# Altium project D AMP.PrjPcb
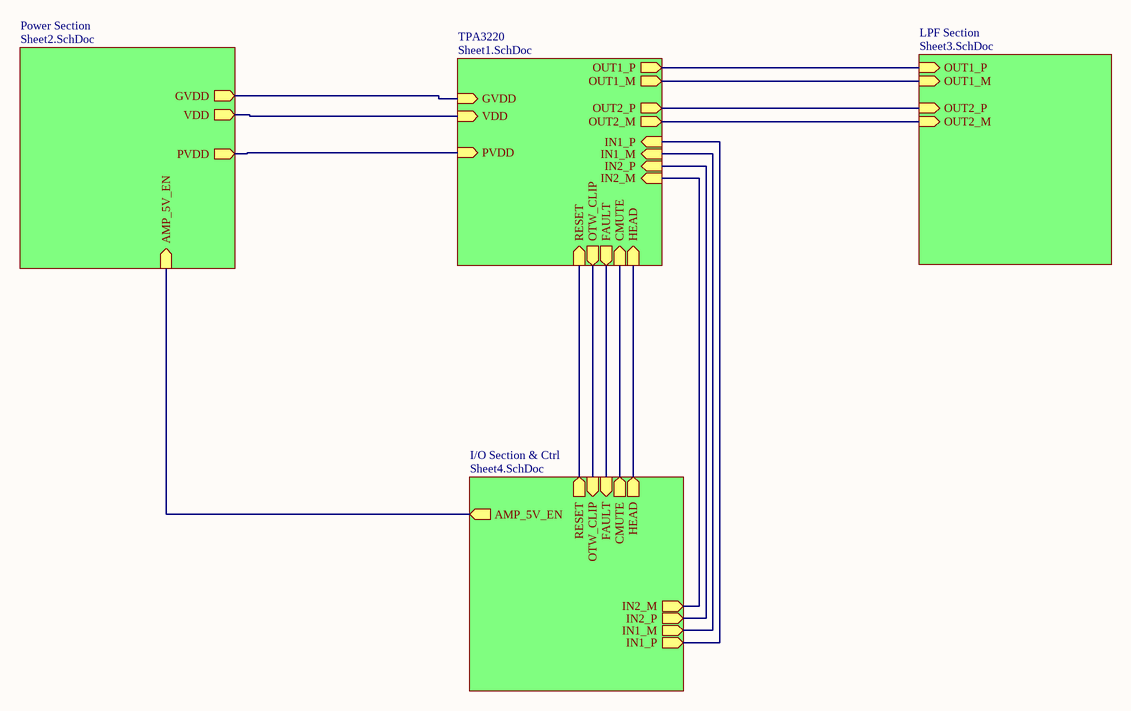
[diagram p0: ROOT_Sheet.SchDoc]
=revision: 1.0; =title: D AMP
5 sheets, 97 parts. Net scope: hierarchical (ports join the sheet entries above them; power ports are global).
Board file: DAMP.PcbDoc
Sheets:
  ROOT_Sheet.SchDoc
    TPA3220 = Sheet1.SchDoc
    I/O Section & Ctrl = Sheet4.SchDoc
    LPF Section = Sheet3.SchDoc
    Power Section = Sheet2.SchDoc

## Sheet ROOT_Sheet.SchDoc: D AMP
size A4; Revision: 1.0; SheetNumber: 5; SheetTotal: 5

### Sub-sheets
I/O Section & Ctrl = Sheet4.SchDoc: AMP_5V_EN (out), HEAD (out), CMUTE (out), FAULT (in), OTW_CLIP (in), IN1_P (out), IN1_M (out), IN2_P (out), IN2_M (out), RESET (out)
LPF Section = Sheet3.SchDoc: OUT1_P (in), OUT1_M (in), OUT2_P (in), OUT2_M (in)
Power Section = Sheet2.SchDoc: GVDD (out), VDD (out), PVDD (out), AMP_5V_EN (in)
TPA3220 = Sheet1.SchDoc: GVDD (in), VDD (in), PVDD (in), OTW_CLIP (out), FAULT (out), CMUTE (in), HEAD (in), OUT1_P (out), OUT1_M (out), OUT2_P (out), OUT2_M (out), IN1_P (in), IN1_M (in), IN2_P (in), IN2_M (in), RESET (in)

### Nets
PVDD: sheet TPA3220/PVDD, sheet Power Section/PVDD
GVDD: sheet TPA3220/GVDD, sheet Power Section/GVDD
OUT1_M: sheet TPA3220/OUT1_M, sheet LPF Section/OUT1_M
OUT1_P: sheet TPA3220/OUT1_P, sheet LPF Section/OUT1_P
OUT2_M: sheet TPA3220/OUT2_M, sheet LPF Section/OUT2_M
OUT2_P: sheet TPA3220/OUT2_P, sheet LPF Section/OUT2_P
VDD: sheet TPA3220/VDD, sheet Power Section/VDD
NetC3_2: sheet TPA3220/RESET, sheet I/O Section & Ctrl/RESET
NetC40_1: sheet TPA3220/IN1_M, sheet I/O Section & Ctrl/IN1_M
NetC40_2: sheet TPA3220/IN1_P, sheet I/O Section & Ctrl/IN1_P
NetC44_1: sheet TPA3220/IN2_M, sheet I/O Section & Ctrl/IN2_M
NetC44_2: sheet TPA3220/IN2_P, sheet I/O Section & Ctrl/IN2_P
NetIC1_3: sheet TPA3220/OTW_CLIP, sheet I/O Section & Ctrl/OTW_CLIP
NetIC1_4: sheet TPA3220/FAULT, sheet I/O Section & Ctrl/FAULT
NetIC1_11: sheet TPA3220/HEAD, sheet I/O Section & Ctrl/HEAD
NetIC1_17: sheet TPA3220/CMUTE, sheet I/O Section & Ctrl/CMUTE
NetJ4_20: sheet I/O Section & Ctrl/AMP_5V_EN, sheet Power Section/AMP_5V_EN

### Notes on the sheet
- Size:
- Date:
- A4
- Author:
- Time:
- Title
- Lovepreet Singh
- Sheet
- Revision:
- of
- File:

## Sheet Sheet1.SchDoc: D AMP
size A4; DocumentNumber: 0001; Revision: 1.0; SheetNumber: 1; SheetTotal: 5
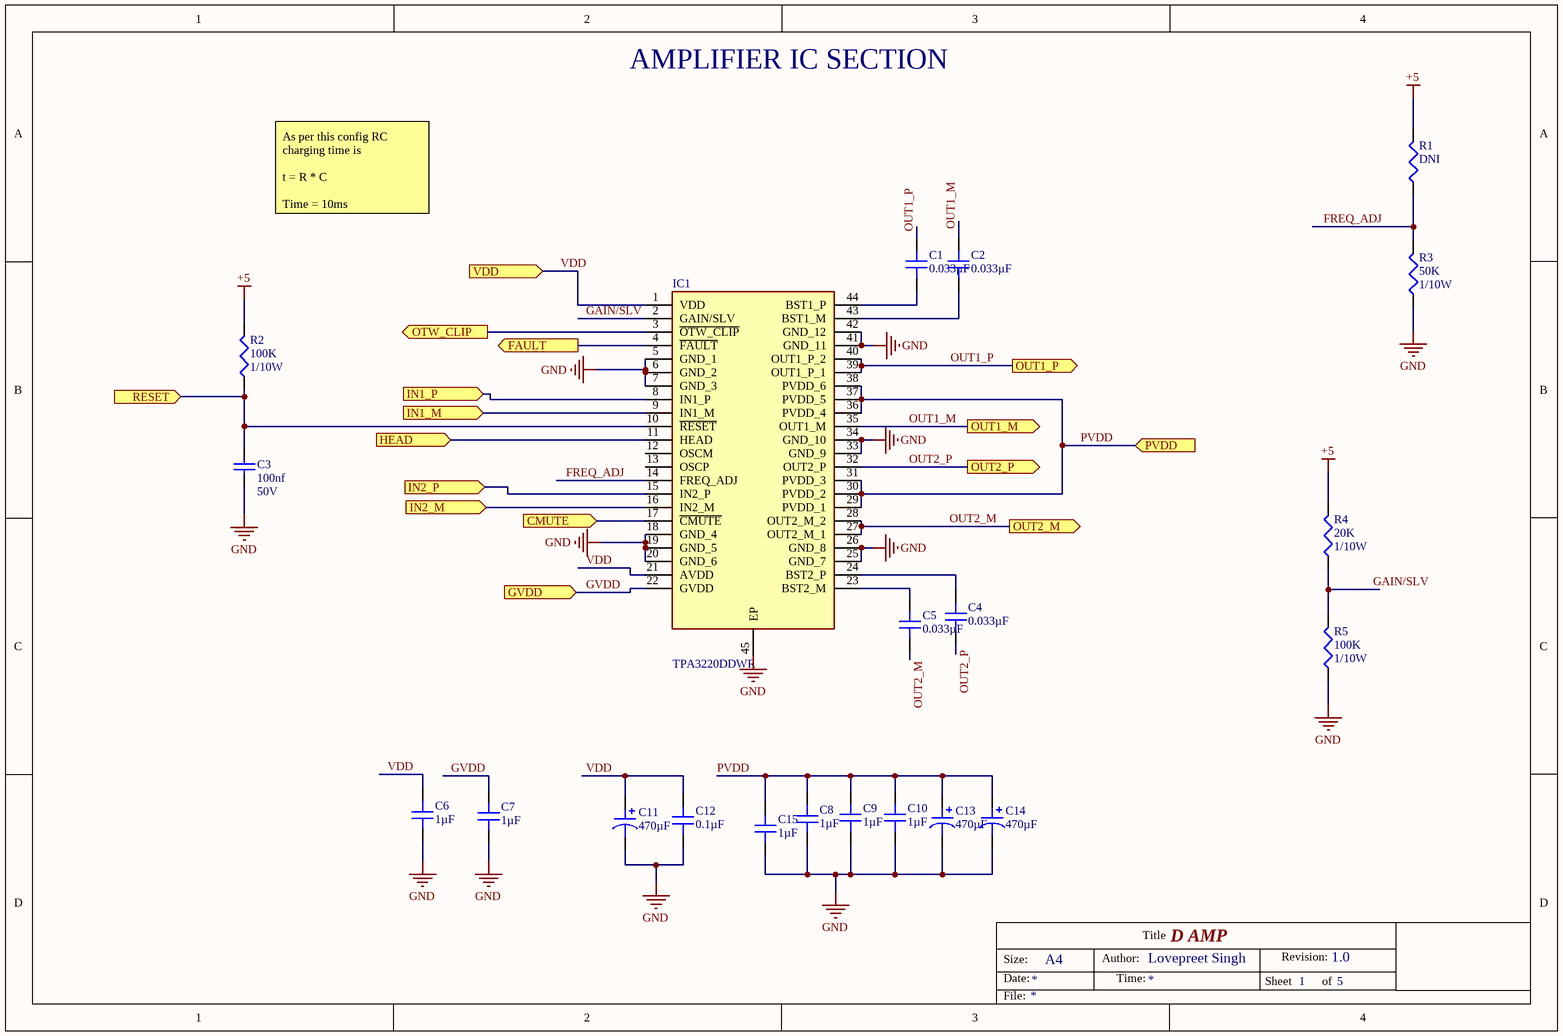
[diagram p1: Sheet1.SchDoc]

### Parts
C1  0.033µF  [CAP 0603_1608]
C2  0.033µF  [CAP 0603_1608]
C3  100nf  VRating: 50V  [C0603]
C4  0.033µF  [CAP 0603_1608]
C5  0.033µF  [CAP 0603_1608]
C6  1µF  [CAP 0805_2012]
C7  1µF  [CAP 0805_2012]
C8  1µF  [CAP 0805_2012]
C9  1µF  [CAP 0805_2012]
C10  1µF  [CAP 0805_2012]
C11  470µF  [CAP TH ALUM ELEC D12.50mm S5.00mm H27.00mm]
C12  0.1µF  [CAP 0805_2012]
C13  470µF  [CAP TH ALUM ELEC D12.50mm S5.00mm H27.00mm]
C14  470µF  [CAP TH ALUM ELEC D12.50mm S5.00mm H27.00mm]
C15  1µF  [CAP 0805_2012]
IC1  TPA3220DDWR  [SOP64P810X120-45N]
R1  DNI  [R0603]
R2  100K  PRating: 1/10W  [R0603]
R3  50K  PRating: 1/10W  [R0603]
R4  20K  PRating: 1/10W  [R0603]
R5  100K  PRating: 1/10W  [R0603]

### Ports
CMUTE (in), FAULT (out), GVDD (in), HEAD (in), IN1_M (in), IN1_P (in), IN2_M (in), IN2_P (in), OTW_CLIP (out), OUT1_M (out), OUT1_P (out), OUT2_M (out), OUT2_P (out), PVDD (in), RESET (in), VDD (in)

### Nets
+5: R1.2 R2.2 R4.2
GND: C3.1 C6.1 C7.1 C8.1 C9.1 C10.1 C11.2 C12.1 C13.2 C14.2 C15.1 IC1.5(GND_1) IC1.6(GND_2) IC1.7(GND_3) IC1.18(GND_4) IC1.19(GND_5) IC1.20(GND_6) IC1.25(GND_7) IC1.26(GND_8) IC1.33(GND_9) IC1.34(GND_10) IC1.41(GND_11) IC1.42(GND_12) IC1.45(EP) R3.1 R5.1
PVDD: C8.2 C9.2 C10.2 C13.1 C14.1 C15.2 IC1.29(PVDD_1) IC1.30(PVDD_2) IC1.31(PVDD_3) IC1.36(PVDD_4) IC1.37(PVDD_5) IC1.38(PVDD_6) ; port PVDD
FREQ_ADJ: IC1.14(FREQ_ADJ) R1.1 R3.2
GAIN/SLV: IC1.2(GAIN/SLV) R4.1 R5.2
GVDD: C7.2 IC1.22(GVDD) ; port GVDD
OUT1_M: C2.2 IC1.35(OUT1_M) ; port OUT1_M
OUT1_P: C1.2 IC1.39(OUT1_P_1) IC1.40(OUT1_P_2) ; port OUT1_P
OUT2_M: C5.1 IC1.27(OUT2_M_1) IC1.28(OUT2_M_2) ; port OUT2_M
OUT2_P: C4.1 IC1.32(OUT2_P) ; port OUT2_P
VDD: C6.2 C11.1 C12.2 IC1.1(VDD) IC1.21(AVDD) ; port VDD
NetC1_1: C1.1 IC1.44(BST1_P)
NetC2_1: C2.1 IC1.43(BST1_M)
NetC3_2: C3.2 IC1.10(~{RESET}) R2.1 ; port RESET
NetC4_2: C4.2 IC1.24(BST2_P)
NetC5_2: C5.2 IC1.23(BST2_M)
NetC40_1: IC1.9(IN1_M) ; port IN1_M
NetC40_2: IC1.8(IN1_P) ; port IN1_P
NetC44_1: IC1.16(IN2_M) ; port IN2_M
NetC44_2: IC1.15(IN2_P) ; port IN2_P
NetIC1_3: IC1.3(~{OTW_CLIP}) ; port OTW_CLIP
NetIC1_4: IC1.4(~{FAULT}) ; port FAULT
NetIC1_11: IC1.11(HEAD) ; port HEAD
NetIC1_17: IC1.17(~{CMUTE}) ; port CMUTE

Not connected (* = marked no-connect by the designer): IC1 12(OSCM) 13(OSCP)

### Notes on the sheet
- AMPLIFIER IC SECTION
- As per this config RC charging time is
  t = R * C
  Time = 10ms
- Size:
- Date:
- A4
- Author:
- Time:
- Title
- Lovepreet Singh
- Sheet
- Revision:
- of
- File:

### Library data of the parts
C1 C2 C4 C5 = C1608X8R2A333K080AB: CAP CER 0.033UF 100V X8R 0603; Manufacturer: TDK Corporation; Tolerance: ±10%; Part Number: C1608X8R2A333K080AB; Value: 0.033µF; Applications: General Purpose; Capacitance: 0.033µF; ComponentLink1Description: Datasheet; ComponentLink1URL: https://product.tdk.com/info/en/catalog/datasheets/mlcc_commercial_hightemp_en.pdf?ref_disty=digikey; ComponentLink2Description: DigiKey Link; ComponentLink2URL: http://digikey.com/product-detail/en/tdk-corporation/C1608X8R2A333K080AB/445-14287-1-ND/3955953; Device Package: 0603 (1608 Metric); Features: High Temperature; LastUpdated: 02-09-2020 01:03:34 AM; Lifecycle Status: Active; Minimum Order: 1; Mounting Type: Surface Mount, MLCC; Operating Temperature: -55°C ~ 150°C; Package / Case: 0603 (1608 Metric); Packaging: TapeAndReel; PartId: 3282; Part Status: Active; Price: 0.05; Series: C; Size / Dimension: 0.063" L x 0.031" W (1.60mm x 0.80mm); Supplier 1: DigiKey; Supplier Part Number 1: 445-14287-1-ND; Temperature Coefficient: X8R; Thickness (Max): 0.035" (0.90mm); Voltage - Rated: 100V
C3 = CAP-00018: CAP CER 100NF 10% 50V X7R 0603; Manufacturer 1: Yageo; Manufacturer 1 PN: CC0603KRX7R9BB104; Manufacturer 2 PN: GRM188R71H104KA93D; Manufacturer 3 PN: 06035C104KAT2A; SAP PN: 1100013274; SMD/TH: SMD; PB-Free: UNKNOWN; DB Ref: CAP-00018; Life Cycle: Released; Value: 100nf; Tolerence: 10%; TRating: X7R; Manufacturer 2: Murata; Manufacturer 3: AVX; ROHS Comp: YES; Operating Temp: -55°C to +125°C; Grade: UNKNOWN
C6-C10 C15 = GCM21BR71H105KA03L: CAP CER 1UF 50V X7R 0805; Manufacturer: Murata Electronics; Tolerance: ±10%; Part Number: GCM21BR71H105KA03L; Value: 1µF; Applications: Automotive; Capacitance: 1µF; ComponentLink1Description: Datasheet; ComponentLink1URL: https://www.murata.com/~/media/webrenewal/support/library/catalog/products/capacitor/mlcc/c03e.ashx?la=en-us; ComponentLink2Description: DigiKey Link; ComponentLink2URL: http://digikey.com/product-detail/en/murata-electronics/GCM21BR71H105KA03L/490-10675-1-ND/5251430; Device Package: 0805 (2012 Metric); LastUpdated: 02-09-2020 01:04:41 AM; Lifecycle Status: Active; Minimum Order: 1; Mounting Type: Surface Mount, MLCC; Operating Temperature: -55°C ~ 125°C; Package / Case: 0805 (2012 Metric); Packaging: TapeAndReel; PartId: 2659; Part Status: Active; Price: 0.08; Ratings: AEC-Q200; Series: GCM; Size / Dimension: 0.079" L x 0.049" W (2.00mm x 1.25mm); Supplier 1: DigiKey; Supplier Part Number 1: 490-10675-1-ND; Temperature Coefficient: X7R; Thickness (Max): 0.055" (1.40mm); Voltage - Rated: 50V
C11 C13 C14 = UBT1H471MHD: CAP 470UF 50V RAD; Manufacturer: Nichicon; Impedance: 55 mOhms; Lifetime @ Temp.: 10000 Hrs @ 125°C; Polarization: Polar; Ripple Current @ High Frequency: 1.65A @ 100kHz; Ripple Current @ Low Frequency: 825mA @ 120Hz; Tolerance: ±20%; Part Number: UBT1H471MHD; Applications: Automotive; Capacitance: 470µF; ComponentLink1Description: Datasheet; ComponentLink1URL: http://nichicon-us.com/english/products/pdfs/e-ubt.pdf; ComponentLink2Description: DigiKey Link; ComponentLink2URL: http://digikey.com/product-detail/en/nichicon/UBT1H471MHD/493-16220-ND/1832524; Device Package: Radial, Can; Height - Seated (Max): 1.063" (27.00mm); LastUpdated: 02-09-2020 01:32:15 AM; Lead Spacing: 0.197" (5.00mm); Lifecycle Status: Active; Minimum Order: 1; Mounting Type: Through Hole; Operating Temperature: -40°C ~ 125°C; Package / Case: Radial, Can; Packaging: Unknown; PartId: 15304; Part Status: Active; Price: 1.65; Series: UBT; Size / Dimension: 0.492" Dia (12.50mm); Supplier 1: DigiKey; Supplier Part Number 1: 493-16220-ND; Value: 470µF; Voltage - Rated: 50V
C12 = AC0805KKX8R9BB104: CAP CER 0805 10% X8R 50V 100NF; Manufacturer: Yageo; Part Number: AC0805KKX8R9BB104; Value: 0.1µF; Applications: Automotive; Capacitance: 0.1µF; ComponentLink1Description: Datasheet; ComponentLink1URL: http://www.yageo.com/documents/recent/AC0805KKX8R9BB104.pdf; ComponentLink2Description: DigiKey Link; ComponentLink2URL: http://digikey.com/product-detail/en/yageo/AC0805KKX8R9BB104/311-4624-1-ND/9699550; Device Package: 0805 (2012 Metric); LastUpdated: 02-09-2020 01:04:20 AM; Lifecycle Status: Active; Minimum Order: 1; Mounting Type: Surface Mount, MLCC; Operating Temperature: -55°C ~ 150°C; Package / Case: 0805 (2012 Metric); Packaging: TapeAndReel; PartId: 14076; Part Status: Active; Price: 0.06; Ratings: AEC-Q200; Series: AC; Size / Dimension: 0.079" L x 0.049" W (2.00mm x 1.25mm); Supplier 1: DigiKey; Supplier Part Number 1: 311-4624-1-ND; Temperature Coefficient: X8R; Thickness (Max): 0.057" (1.45mm); Tolerance: ±10%; Voltage - Rated: 50V
IC1 = TPA3220DDWR: Integrated Circuit; Manufacturer_Name: Texas Instruments; Datasheet Link: http://www.ti.com/lit/gpn/tpa3220; Height: 1.2mm; Mouser2 Part Number: 595-TPA3220DDWR; Mouser2 Price/Stock: https://www.mouser.com/Search/Refine.aspx?Keyword=595-TPA3220DDWR; Manufacturer_Part_Number: TPA3220DDWR
R1 R4 = RES-00050: RES SMD 20K 1% 1/10W 0603; Manufacturer 1: Yageo; Manufacturer 1 PN: RC0603FR-0720KL; Manufacturer 2 PN: AC0603FR-1020KL; Manufacturer 3 PN: RK73H1JTTD2002F; SAP PN: 1100013992; Tolerance(%): 1; Grade: UNKNOWN; DB Ref: RES-00050; Life Cycle: Released; Manufacturer 2: Yageo; Manufacturer 3: KOA Speer; ROHS Comp: YES; Operating Temp: -55°C to +125°C; SMD/TH: SMD; PB-Free: UNKNOWN
  R1: Value: DNI
  R4: Value: 20K
R2 R5 = RES-00024: RES SMD 100K 1% 1/10W 0603; Manufacturer 1: Yageo; Manufacturer 1 PN: RC0603FR-07100KL; Manufacturer 2 PN: RMCF0603FT100K; Manufacturer 3 PN: RK73H1JRTTD1003F; SAP PN: 1100013339; Tolerance(%): 1; Cost Price: $0.1; Grade: UNKNOWN; DB Ref: RES-00024; Life Cycle: Released; Value: 100K; Manufacturer 2: Stackpole; Manufacturer 3: KOA Speer; ROHS Comp: YES; Operating Temp: -55°C to +155°C; SMD/TH: SMD; PB-Free: UNKNOWN
R3 = RES-00125: RES 50K OHM 1% 1/10W 0603; Manufacturer 1: Yageo; Manufacturer 1 PN: RC0603FR-0750KL; SAP PN: 1100016036; Tolerance(%): 1; SMD/TH: SMD; Grade: UNKNOWN; DB Ref: RES-00125; Life Cycle: Released; Value: 50K; ROHS Comp: YES; Operating Temp: -55°C to +155°C; PB-Free: UNKNOWN

## Sheet Sheet4.SchDoc: D AMP
size A4; Revision: 1.0; SheetNumber: 4; SheetTotal: 5
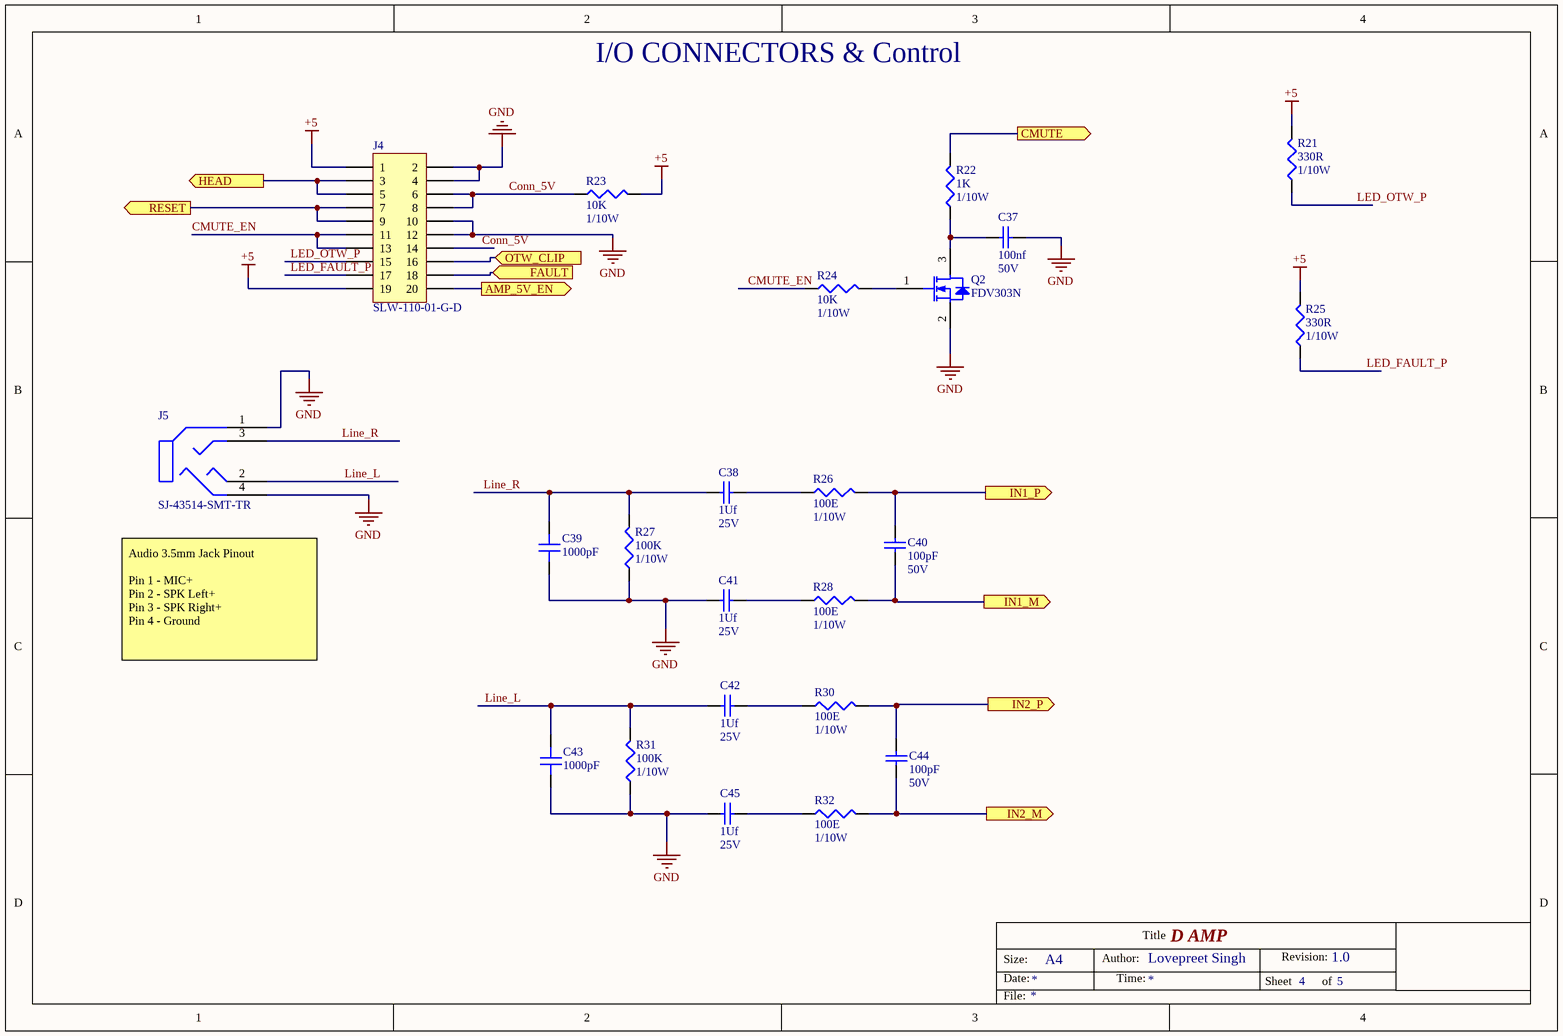
[diagram p2: Sheet4.SchDoc]

### Parts
C37  100nf  VRating: 50V  [C0603]
C38  1Uf  VRating: 25V  [C0603]
C39  1000pF  [CAP 0603_1608]
C40  100pF  VRating: 50V  [C0603]
C41  1Uf  VRating: 25V  [C0603]
C42  1Uf  VRating: 25V  [C0603]
C43  1000pF  [CAP 0603_1608]
C44  100pF  VRating: 50V  [C0603]
C45  1Uf  VRating: 25V  [C0603]
J4  SLW-110-01-G-D  [HDR2X10]
J5  SJ-43514-SMT-TR  [CUI SJ-43514-SMT-TR]
Q2  FDV303N  [SOT23_123]
R21  330R  PRating: 1/10W  [R0603]
R22  1K  PRating: 1/10W  [R0603]
R23  10K  PRating: 1/10W  [R0603]
R24  10K  PRating: 1/10W  [R0603]
R25  330R  PRating: 1/10W  [R0603]
R26  100E  PRating: 1/10W  [R0603]
R27  100K  PRating: 1/10W  [R0603]
R28  100E  PRating: 1/10W  [R0603]
R30  100E  PRating: 1/10W  [R0603]
R31  100K  PRating: 1/10W  [R0603]
R32  100E  PRating: 1/10W  [R0603]

### Ports
AMP_5V_EN (out), CMUTE (out), FAULT (in), HEAD (out), IN1_M (out), IN1_P (out), IN2_M (out), IN2_P (out), OTW_CLIP (in), RESET (out)

### Nets
+5: J4.1 J4.19 R21.2 R23.2 R25.2
GND: C37.2 C39.1 C41.1 C43.1 C45.1 J4.2 J4.4 J4.10 J4.12 J5.1(SLEEVE) J5.4(RING_2) Q2.2(S) R27.1 R31.1
CMUTE_EN: J4.11 J4.13 R24.1
Conn_5V: J4.6 J4.8 J4.14 R23.1
LED_FAULT_P: J4.17 R25.1
LED_OTW_P: J4.15 R21.1
Line_L: C42.1 C43.2 J5.2(TIP) R31.2
Line_R: C38.1 C39.2 J5.3(RING_1) R27.2
NetC3_2: J4.7 J4.9 ; port RESET
NetC37_1: C37.1 Q2.3(D) R22.1
NetC38_2: C38.2 R26.1
NetC40_1: C40.1 R28.2 ; port IN1_M
NetC40_2: C40.2 R26.2 ; port IN1_P
NetC41_2: C41.2 R28.1
NetC42_2: C42.2 R30.1
NetC44_1: C44.1 R32.2 ; port IN2_M
NetC44_2: C44.2 R30.2 ; port IN2_P
NetC45_2: C45.2 R32.1
NetIC1_3: J4.16 ; port OTW_CLIP
NetIC1_4: J4.18 ; port FAULT
NetIC1_11: J4.3 J4.5 ; port HEAD
NetIC1_17: R22.2 ; port CMUTE
NetJ4_20: J4.20 ; port AMP_5V_EN
NetQ2_1: Q2.1(G) R24.2

### Notes on the sheet
- I/O CONNECTORS & Control
- (near J5) Audio 3.5mm Jack Pinout
  Pin 1 - MIC+
  Pin 2 - SPK Left+
  Pin 3 - SPK Right+
  Pin 4 - Ground
- Size:
- Date:
- A4
- Author:
- Time:
- Title
- Lovepreet Singh
- Sheet
- Revision:
- of
- File:

### Library data of the parts
C37 = CAP-00018: as C3 on sheet Sheet1; DB Ref: CAP-00018; Life Cycle: Released; Value: 100nf; Tolerence: 10%; TRating: X7R; Manufacturer 2: Murata; Manufacturer 3: AVX; ROHS Comp: YES; Operating Temp: -55°C to +125°C; Grade: UNKNOWN
C38 C41 C42 C45 = CAP-00113: CAP MLCC SMD 25V 1uF 10% X7R 0603; Manufacturer 1: KEMET; Manufacturer 1 PN: C0603C105K3RACTU; SAP PN: 1100016000; PB-Free: YES; Grade: Commercial; DB Ref: CAP-00113; Life Cycle: Released; Value: 1Uf; Tolerence: 10%; TRating: X7R; ROHS Comp: YES; Operating Temp: -55°C to +125°C; SMD/TH: SMD
C39 C43 = C0603C102K4RECAUTO: CAP CER 0603 1NF 16V X7R 10%; Manufacturer: KEMET; Part Number: C0603C102K4RECAUTO; Value: 1000pF; Applications: Automotive, ESD Protection; Capacitance: 1000pF; ComponentLink1Description: Datasheet; ComponentLink1URL: https://api.kemet.com/component-edge/download/datasheet/C0603C102K4RECAUTO.pdf; ComponentLink2Description: DigiKey Link; ComponentLink2URL: http://digikey.com/product-detail/en/kemet/C0603C102K4RECAUTO/399-17878-1-ND/8640545; Device Package: 0603 (1608 Metric); LastUpdated: 02-09-2020 01:03:36 AM; Lifecycle Status: Active; Minimum Order: 1; Mounting Type: Surface Mount, MLCC; Operating Temperature: -55°C ~ 125°C; Package / Case: 0603 (1608 Metric); Packaging: TapeAndReel; PartId: 2316; Part Status: Active; Price: 0.02; Ratings: AEC-Q200; Series: ESD SMD Auto X7R; Size / Dimension: 0.063" L x 0.031" W (1.60mm x 0.80mm); Supplier 1: DigiKey; Supplier Part Number 1: 399-17878-1-ND; Temperature Coefficient: X7R; Thickness (Max): 0.034" (0.87mm); Tolerance: ±10%; Voltage - Rated: 16V
C40 C44 = CAP-00096: CAP 100PF 5% 50V 0603; Manufacturer 1: YAGEO; Manufacturer 1 PN: CC0603JRNPO9BN101; Manufacturer 2 PN: 06035A101JAT4A; SAP PN: 1100015745; TRating: C0G(NPO); SMD/TH: SMD; PB-Free: UNKNOWN; DB Ref: CAP-00096; Life Cycle: Released; Value: 100pF; Tolerence: 5%; Manufacturer 2: AVX; ROHS Comp: YES; Operating Temp: -55°C to +125°C; Grade: UNKNOWN
J4 = CON-00033: CONN HSG 20PIN 2.54MM STR DUALROW; Manufacturer 1: Samtec; SAP PN: 1100014978; Current Rating: 5.2A; SMD/TH: TH; PB-Free: UNKNOWN; DB Ref: CON-00033; Life Cycle: Released; Manufacturer 1 PN: SLW-110-01-G-D; ROHS Comp: YES; Operating Temp: -55°C to +120°C; Grade: UNKNOWN
J5 = SJ-43514-SMT-TR: CONN JACK 4COND 3.5MM SMD R/A; Manufacturer: CUI Devices; Actual Diameter: 0.142" (3.60mm); Connector Type: Phone Jack; Gender: Female; Industry Recognized Mating Diameter: 3.50mm (0.141", 1/8", Mini Plug) - Headphone; Internal Switch(s): Does Not Contain Switch; Number of Positions/Contacts: 4 Conductors, 4 Contacts; Shielding: Unshielded; Signal Lines: Stereo (4 Conductor, TRRS); Part Number: SJ-43514-SMT-TR; ComponentLink1Description: Datasheet; ComponentLink1URL: https://www.cuidevices.com/product/resource/digikeypdf/sj-4351x-smt.pdf; ComponentLink2Description: DigiKey Link; ComponentLink2URL: http://digikey.com/product-detail/en/cui-devices/SJ-43514-SMT-TR/CP-43514SJCT-ND/669734; Features: Board Guide; LastUpdated: 06-09-2020 11:26:53 AM; Lifecycle Status: Active; Minimum Order: 1; Mounting Type: Surface Mount, Right Angle; Operating Temperature: -20°C ~ 85°C; Packaging: TapeAndReel; Part Status: Active; Price: 0.58; Series: SJ; Supplier 1: DigiKey; Supplier Part Number 1: CP-43514SJCT-ND; Termination: Solder
Q2 = TRS-00003: TRANS N-CH MOSFET 25V 0.68A SOT23; Manufacturer 1: Fairchild; SAP PN: 1100013323; Type: NMOS; SMD/TH: SMD; Grade: UNKNOWN; DB Ref: TRS-00003; Life Cycle: Released; VRating: 25V; Irating: 0.68A; Manufacturer 1 PN: FDV303N; ROHS Comp: YES; Operating Temp: -55°C to +150°C; Storage Temp: -55°C to +150°C; PB-Free: UNKNOWN
R21 R25 = RES-00132: RES  SMD 330R 5% 1/10W 0603; Manufacturer 1: YAGEO; Manufacturer 1 PN: RC0603JR-07330RL; Manufacturer 2 PN: AC0603JR-07330RL; Manufacturer 3 PN: ERJ-3GEYJ331V; SAP PN: 1100015977; Tolerance(%): 5; Grade: UNKNOWN; DB Ref: RES-00132; Life Cycle: Released; Value: 330R; Manufacturer 2: YAGEO; Manufacturer 3: Panasonic; ROHS Comp: YES; Operating Temp: -55°C to +155°C; SMD/TH: SMD; PB-Free: UNKNOWN
R22 = RES-00017: RES SMD 1K 1% 1/10W 0603; Manufacturer 1: Yageo; Manufacturer 1 PN: RC0603FR-071KL; Manufacturer 2 PN: RMCF0603FT1K00; Manufacturer 3 PN: ERJ-PA3F1001V; SAP PN: 1100013331; Tolerance(%): 1; Grade: UNKNOWN; DB Ref: RES-00017; Life Cycle: Released; Value: 1K; Manufacturer 2: Stackpole; Manufacturer 3: PANASONIC; ROHS Comp: YES; Operating Temp: -55°C to +155°C; SMD/TH: SMD; PB-Free: UNKNOWN
R23 R24 = RES-00012: RES SMD 10K 1% 1/10W 0603; Manufacturer 1: Yageo; Manufacturer 1 PN: RC0603FR-0710KL; Manufacturer 2 PN: ERJ-3EKF1002V; Manufacturer 3 PN: RK73H1JRTTD1002F; SAP PN: 1100013326; Tolerance(%): 1; Grade: UNKNOWN; DB Ref: RES-00012; Life Cycle: Released; Value: 10K; Manufacturer 2: Panasonic; Manufacturer 3: KOA Speer; ROHS Comp: YES; Operating Temp: -55°C to +155°C; SMD/TH: SMD; PB-Free: UNKNOWN
R26 R28 R30 R32 = RES-00018: RES SMD 100E 1% 1/10W 0603; Manufacturer 1: Yageo; Manufacturer 1 PN: RC0603FR-07100RL; Manufacturer 2 PN: RK73H1JRTTD1000F; Manufacturer 3 PN: 0603WAF1000T5E; SAP PN: 1100013332; Tolerance(%): 1; Grade: UNKNOWN; DB Ref: RES-00018; Life Cycle: Released; Value: 100E; Manufacturer 2: KOA Speer; Manufacturer 3: ROYAL OHM; ROHS Comp: YES; Operating Temp: -55°C to +155°C; SMD/TH: SMD; PB-Free: UNKNOWN
R27 R31 = RES-00024: as R2 on sheet Sheet1; DB Ref: RES-00024; Life Cycle: Released; Value: 100K; Manufacturer 2: Stackpole; Manufacturer 3: KOA Speer; ROHS Comp: YES; Operating Temp: -55°C to +155°C; SMD/TH: SMD; PB-Free: UNKNOWN

## Sheet Sheet3.SchDoc: D AMP
size A4; Revision: 1.0; SheetNumber: 3; SheetTotal: 5
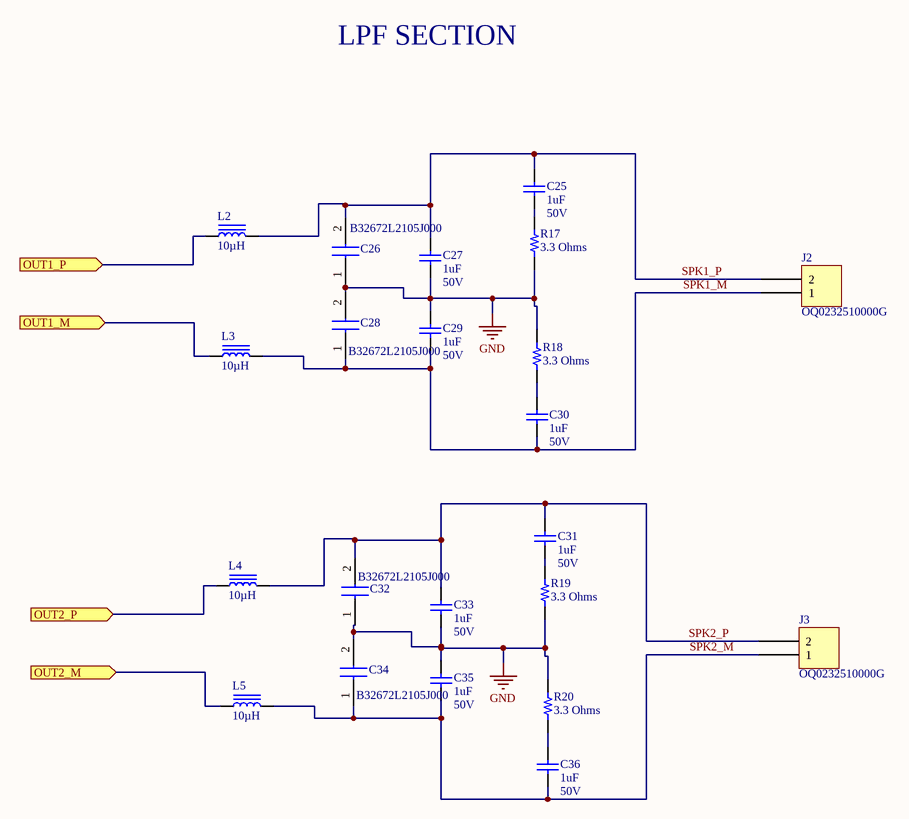
[diagram p3: Sheet3.SchDoc]

### Parts
C25  1uF  VRating: 50V  [C0805]
C26  B32672L2105J000  [B32672L2105J000]
C27  1uF  VRating: 50V  [C0805]
C28  B32672L2105J000  [B32672L2105J000]
C29  1uF  VRating: 50V  [C0805]
C30  1uF  VRating: 50V  [C0805]
C31  1uF  VRating: 50V  [C0805]
C32  B32672L2105J000  [B32672L2105J000]
C33  1uF  VRating: 50V  [C0805]
C34  B32672L2105J000  [B32672L2105J000]
C35  1uF  VRating: 50V  [C0805]
C36  1uF  VRating: 50V  [C0805]
J2  OQ0232510000G  [FCI 06-381-2PIN]
J3  OQ0232510000G  [FCI 06-381-2PIN]
L2  10µH  [TDK SLF12575]
L3  10µH  [TDK SLF12575]
L4  10µH  [TDK SLF12575]
L5  10µH  [TDK SLF12575]
R17  3.3 Ohms  [RES 0805_2012]
R18  3.3 Ohms  [RES 0805_2012]
R19  3.3 Ohms  [RES 0805_2012]
R20  3.3 Ohms  [RES 0805_2012]

### Ports
OUT1_M (in), OUT1_P (in), OUT2_M (in), OUT2_P (in)

### Nets
GND: C26.1 C27.1 C28.2 C29.2 C32.1 C33.1 C34.2 C35.2 R17.1 R18.2 R19.1 R20.2
OUT1_M: L3.1 ; port OUT1_M
OUT1_P: L2.1 ; port OUT1_P
OUT2_M: L5.1 ; port OUT2_M
OUT2_P: L4.1 ; port OUT2_P
SPK1_M: C28.1 C29.1 C30.1 J2.1 L3.2
SPK1_P: C25.2 C26.2 C27.2 J2.2 L2.2
SPK2_M: C34.1 C35.1 C36.1 J3.1 L5.2
SPK2_P: C31.2 C32.2 C33.2 J3.2 L4.2
NetC25_1: C25.1 R17.2
NetC30_2: C30.2 R18.1
NetC31_1: C31.1 R19.2
NetC36_2: C36.2 R20.1

### Notes on the sheet
- LPF SECTION
- Size:
- Date:
- A4
- Author:
- Time:
- Title
- Lovepreet Singh
- Sheet
- Revision:
- of
- File:

### Library data of the parts
C25 C27 C29-C31 C33 C35 C36 = CAP-00145: CAP 1uF 10% 50V X7R 0805; Manufacturer 1: KEMET; Manufacturer 1 PN: C0805C105K5RACTU; SAP PN: 1100016592; Cost Price: 25.55; SMD/TH: SMD; PB-Free: YES; Grade: Commercial; DB Ref: CAP-00145; Life Cycle: Released; Value: 1uF; Tolerence: 10%; ROHS Comp: YES; Operating Temp: -55°C to +105°C
C26 C28 C32 C34 = B32672L2105J000: Capacitor; Manufacturer_Name: TDK; Datasheet Link: https://product.tdk.com/en/search/capacitor/film/mkp_mfp/info?part_no=B32672L2105J000; Height: 18.5mm; Manufacturer_Part_Number: B32672L2105J000; Mouser Part Number: 871-B32672L2105J000; Mouser Price/Stock: https://www.mouser.co.uk/ProductDetail/EPCOS-TDK/B32672L2105J000?qs=W0yvOO0ixfGLW%2FEYLRZvuA%3D%3D
J2 J3 = OQ0232510000G: TERM BLOCK HDR 2POS 90DEG 3.81MM; Manufacturer: Amphenol Anytek; Current - UL: 10A; Header Orientation: 90°, Right Angle; Number of Levels: 1; Number of Positions: 2; Pitch: 0.150" (3.81mm); Voltage - UL: 300V; Part Number: OQ0232510000G; Color: Green; ComponentLink1Description: Datasheet; ComponentLink1URL: http://portal.fciconnect.com/Comergent//fci/drawing/oqxx32x100j0g.pdf; ComponentLink2Description: DigiKey Link; ComponentLink2URL: //digikey.com/product-detail/en/amphenol-anytek/OQ0232510000G/609-3819-ND/2261255; Contact Mating Finish: Tin; LastUpdated: 16-12-2019 07:14:30 PM; Lifecycle Status: 0; Minimum Order: 1; Mounting Type: Through Hole; Operating Temperature: -40°C ~ 115°C; Packaging: Bulk; Part Status: Active; Positions Per Level: 2; Price: 0.49; Series: 06-381; Supplier 1: DigiKey; Supplier Part Number 1: 609-3819-ND; Termination Style: Solder; Type: Header, Male Pins, Shrouded (4 Side)
L2-L5 = SLF12575T-100M5R4-PF: FIXED IND 10UH 5.4A 15.6 MOHM; Manufacturer: TDK Corporation; Current - Saturation: 5.5A; DC Resistance (DCR): 18.7mOhm Max; Inductance Frequency - Test: 1kHz; Material - Core: Ferrite; Shielding: Shielded; Tolerance: ±20%; Type: Wirewound; Part Number: SLF12575T-100M5R4-PF; ComponentLink1Description: Datasheet; ComponentLink1URL: https://product.tdk.com/info/en/catalog/datasheets/inductor_commercial_power_slf12575_en.pdf?ref_disty=digikey; ComponentLink2Description: DigiKey Link; ComponentLink2URL: http://digikey.com/product-detail/en/tdk-corporation/SLF12575T-100M5R4-PF/445-174408-1-ND/5880182; Current Rating (Amps): 5.4A; Device Package: Nonstandard; Height - Seated (Max): 0.309" (7.85mm); Inductance: 10µH; LastUpdated: 02-09-2020 01:22:14 AM; Lifecycle Status: Active; Minimum Order: 1; Mounting Type: Surface Mount; Operating Temperature: -40°C ~ 105°C; Package / Case: Nonstandard; Packaging: TapeAndReel; PartId: 135; Part Status: Active; Price: 0.94; Series: SLF; Size / Dimension: 0.492" L x 0.492" W (12.50mm x 12.50mm); Supplier 1: DigiKey; Supplier Part Number 1: 445-174408-1-ND; Value: 10µH
R17-R20 = CRCW08053R30FKEAHP: RES SMD 3.3 OHM 1% 1/2W 0805; Manufacturer: Vishay Dale; Power (Watts): 0.5W, 1/2W; Temperature Coefficient: ±100ppm/°C; Part Number: CRCW08053R30FKEAHP; Value: 3.3 Ohms; ComponentLink1Description: Datasheet; ComponentLink1URL: http://www.vishay.com/docs/20043/crcwhpe3.pdf; ComponentLink2Description: DigiKey Link; ComponentLink2URL: http://digikey.com/product-detail/en/vishay-dale/CRCW08053R30FKEAHP/541-3.30TCT-ND/5326912; Composition: Thick Film; Device Package: 0805 (2012 Metric); Features: Automotive AEC-Q200, Pulse Withstanding; Height - Seated (Max): 0.020" (0.50mm); LastUpdated: 02-09-2020 01:15:22 AM; Lifecycle Status: Active; Minimum Order: 1; Number of Terminations: 2; Operating Temperature: -55°C ~ 155°C; Package / Case: 0805 (2012 Metric); Packaging: TapeAndReel; PartId: 28521; Part Status: Active; Price: 0.04; Ratings: AEC-Q200; Resistance: 3.3 Ohms; Series: CRCW-HP; Size / Dimension: 0.079" L x 0.049" W (2.00mm x 1.25mm); Supplier 1: DigiKey; Supplier Part Number 1: 541-3.30TCT-ND; Supplier Device Package: 0805; Tolerance: ±1%

## Sheet Sheet2.SchDoc: D AMP
size A4; Revision: 1.0; SheetNumber: 2; SheetTotal: 5
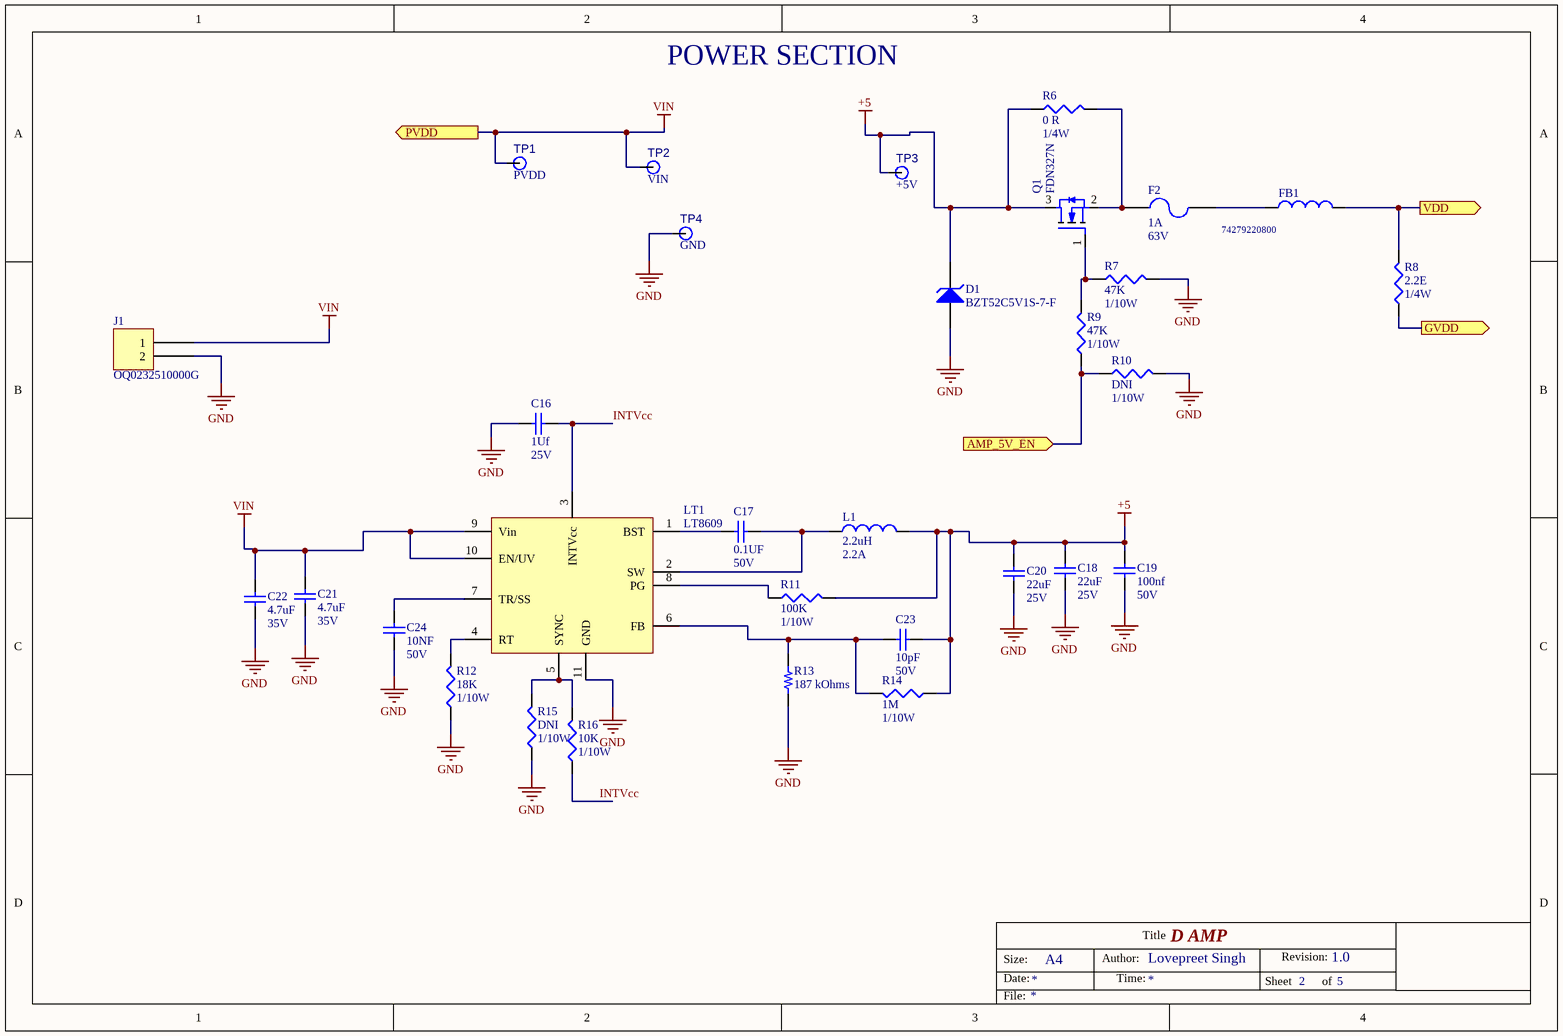
[diagram p4: Sheet2.SchDoc]

### Parts
C16  1Uf  VRating: 25V  [C0603]
C17  0.1UF  VRating: 50V  [2P0603R]
C18  22uF  VRating: 25V  [C1206]
C19  100nf  VRating: 50V  [C0603]
C20  22uF  VRating: 25V  [C1206]
C21  4.7uF  VRating: 35V  [C0603]
C22  4.7uF  VRating: 35V  [C0603]
C23  10pF  VRating: 50V  [C0603]
C24  10NF  VRating: 50V  [C0603]
D1  BZT52C5V1S-7-F  [SOD-323]
F2  1A  VRating: 63V  [FUSE1206]
FB1  74279220800  [L0805]
J1  OQ0232510000G  [FCI 06-381-2PIN]
L1  2.2uH  IRating: 2.2A  [CDMC252012]
LT1  LT8609  [MSOP-10]
Q1  FDN327N  [SOT23_123]
R6  0 R  PRating: 1/4W  [R1206]
R7  47K  PRating: 1/10W  [R0603]
R8  2.2E  PRating: 1/4W  [R1206]
R9  47K  PRating: 1/10W  [R0603]
R10  DNI  PRating: 1/10W  [R0603]
R11  100K  PRating: 1/10W  [R0603]
R12  18K  PRating: 1/10W  [R0603]
R13  187 kOhms  [RES 0603_1608]
R14  1M  PRating: 1/10W  [R0603]
R15  DNI  PRating: 1/10W  [R0603]
R16  10K  PRating: 1/10W  [R0603]
TP1  PVDD  [TP_THROUGH]  (no BOM)
TP2  VIN  [TP_THROUGH]  (no BOM)
TP3  +5V  [TP_THROUGH]  (no BOM)
TP4  GND  [TP_THROUGH]  (no BOM)

### Ports
AMP_5V_EN (in), GVDD (out), PVDD (out), VDD (out)

### Nets
+5: C18.2 C19.2 C20.2 C23.2 D1.K L1.2 Q1.3(D) R6.1 R11.2 R14.1 TP3.1
GND: C16.1 C18.1 C19.1 C20.1 C21.1 C22.1 C24.1 D1.A J1.2 LT1.11(GND) R7.2 R10.2 R12.1 R13.1 R15.1 TP4.1
VIN: C21.2 C22.2 J1.1 LT1.9(Vin) LT1.10(EN/UV) TP1.1 TP2.1 ; port PVDD  [project net PVDD]
GVDD: R8.1 ; port GVDD
INTVcc: C16.2 LT1.3(INTVcc) R16.1
VDD: FB1.2 R8.2 ; port VDD
NetC17_1: C17.1 LT1.1(BST)
NetC17_2: C17.2 L1.1 LT1.2(SW)
NetC23_1: C23.1 LT1.6(FB) R13.2 R14.2
NetC24_2: C24.2 LT1.7(TR/SS)
NetF2_1: F2.1 Q1.2(S) R6.2
NetF2_2: F2.2 FB1.1
NetJ4_20: R9.1 R10.1 ; port AMP_5V_EN
NetLT1_4: LT1.4(RT) R12.2
NetLT1_5: LT1.5(SYNC) R15.2 R16.2
NetLT1_8: LT1.8(PG) R11.1
NetQ1_1: Q1.1(G) R7.1 R9.2

### Notes on the sheet
- POWER SECTION
- Size:
- Date:
- A4
- Author:
- Time:
- Title
- Lovepreet Singh
- Sheet
- Revision:
- of
- File:

### Library data of the parts
C16 = CAP-00113: as C38 on sheet Sheet4; DB Ref: CAP-00113; Life Cycle: Released; Value: 1Uf; Tolerence: 10%; TRating: X7R; ROHS Comp: YES; Operating Temp: -55°C to +125°C; SMD/TH: SMD
C17 = CAP-00148: CAP CER 0.1UF 10% 50V X7R 0603; Manufacturer 1: AVX; Manufacturer 1 PN: 06035C104KAT2A; Manufacturer 2 PN: CC0603KRX7R9BB104; Manufacturer 3 PN: C0603C104K5RACTU; SAP PN: 1100013821; SMD/TH: SMD; PB-Free: YES; Grade: UNKNOWN; DB Ref: CAP-00148; Life Cycle: Released; Value: 0.1UF; Tolerence: 10%; TRating: X7R; ROHS Comp: YES; Operating Temp: -55°C to +125°C; Manufacturer 2: YAGEO; Manufacturer 3: KEMET
C18 C20 = CAP-00019: CAP CER 22uF 20% 25V X5R 1206; Manufacturer 1: Yageo; Manufacturer 1 PN: CC1206MKX5R8BB226; Manufacturer 2 PN: GRM31CR61E226ME15L; Manufacturer 3 PN: TMK316BBJ226ML-T; SAP PN: 1100013275; SMD/TH: SMD; PB-Free: UNKNOWN; DB Ref: CAP-00019; Life Cycle: Released; Value: 22uF; Tolerence: 20%; TRating: X5R; Manufacturer 2: Murata; Manufacturer 3: Taiyo Yuden; ROHS Comp: YES; Operating Temp: -55°C to +85°C; Grade: UNKNOWN
C19 = CAP-00018: as C3 on sheet Sheet1; DB Ref: CAP-00018; Life Cycle: Released; Value: 100nf; Tolerence: 10%; TRating: X7R; Manufacturer 2: Murata; ROHS Comp: YES; Operating Temp: -55°C to +125°C; Grade: UNKNOWN; Manufacturer 3: AVX
C21 C22 = CAP-00063: CAP CER 4.7UF 20% 35V X5R 0603; Manufacturer 1: MURATA; Manufacturer 1 PN: ZRB18AR6YA475ME05L; Manufacturer 2 PN: C1608X5R1V475K080AC; Manufacturer 3 PN: GRM188R6YA475KE15J; SAP PN: 1100014582; SMD/TH: SMD; PB-Free: UNKNOWN; Grade: Commercial; Cost Price: $0.36; DB Ref: CAP-00063; Life Cycle: Released; Value: 4.7uF; Tolerence: 20%; TRating: X5R; ROHS Comp: YES; Operating Temp: -55°C to +85°C; Manufacturer 2: TDK; Manufacturer 3: MURATA
C23 = CAP-00095: CAP 10PF 5% 50V 0603; Manufacturer 1: YAGEO; Manufacturer 1 PN: CC0603JRNPO9BN100; Manufacturer 2 PN: 06035A100JAT2A; SAP PN: 1100015723; TRating: C0G(NPO); SMD/TH: SMD; PB-Free: UNKNOWN; DB Ref: CAP-00095; Life Cycle: Released; Value: 10pF; Tolerence: 5%; Manufacturer 2: AVX; ROHS Comp: YES; Operating Temp: -55°C to +125°C; Grade: UNKNOWN
C24 = CAP-00022: CAP CER 10NF 10% 50V X7R 0603; Manufacturer 1: Yageo; Manufacturer 1 PN: CC0603KRX7R9BB103; Manufacturer 2 PN: C0603C103K5RACTU; Manufacturer 3 PN: 06035C103KAQ2A; SAP PN: 1100013278; SMD/TH: SMD; PB-Free: UNKNOWN; Grade: Commercial; DB Ref: CAP-00022; Life Cycle: Released; Value: 10NF; Tolerence: 10%; TRating: X7R; ROHS Comp: YES; Operating Temp: -55°C to +125°C; Manufacturer 2: Kemet; Manufacturer 3: AVX
D1 = DIO-00030: DIODE ZENER 5.1V 200MW SOD323; Manufacturer 1: Diodes Inc; IRating: 2uA; SMD/TH: SMD; PB-Free: YES; Grade: UNKNOWN; DB Ref: DIO-00030; Life Cycle: Preliminary; VRating: 5.1V; Manufacturer 1 PN: BZT52C5V1S-7-F; ROHS Comp: YES; Operating Temp: -65°C to +150°C; Storage Temp: -65°C to +150°C
F2 = FUZ-00001: Fuse 1A 63V Slow Blow SMD 1206; Manufacturer 1: BEL FUSE; Manufacturer 1 PN: C1S 1; Manufacturer 2 PN: 12H1100C; SAP PN: 1100013300; Grade: UNKNOWN; PB-Free: YES; DB Ref: FUZ-00001; Life Cycle: Released; IRating: 1A; Manufacturer 2: LS; ROHS Comp: YES; Operating Temp: -55℃ to +125℃; SMD/TH: SMD
FB1 = FER-00017: IND FERRITE CHIP 80 OHM 4A 0805; Manufacturer 1: Wurth; SAP PN: 1100016692; Impedance: 80E; SMD/TH: SMD; Grade: AEC-Q200; PB-Free: UNKNOWN; DB Ref: FER-00017; Lifecycle: Released; IRating: 4A; Manufacturer 1 PN: 74279220800; ROHS Comp: YES; Operating Temp: -55°C to +125°C
J1 = OQ0232510000G: as J2 on sheet Sheet3; Part Number: OQ0232510000G; Color: Green; ComponentLink1Description: Datasheet; ComponentLink1URL: http://portal.fciconnect.com/Comergent//fci/drawing/oqxx32x100j0g.pdf; ComponentLink2Description: DigiKey Link; ComponentLink2URL: //digikey.com/product-detail/en/amphenol-anytek/OQ0232510000G/609-3819-ND/2261255; Contact Mating Finish: Tin; LastUpdated: 16-12-2019 07:14:30 PM; Lifecycle Status: 0; Minimum Order: 1; Mounting Type: Through Hole; Operating Temperature: -40°C ~ 115°C; Packaging: Bulk; Part Status: Active; Positions Per Level: 2; Price: 0.49; Series: 06-381; Supplier 1: DigiKey; Supplier Part Number 1: 609-3819-ND; Termination Style: Solder; Type: Header, Male Pins, Shrouded (4 Side)
L1 = IND-00008: FIXED IND 2.2UH 2A 168 MOHM SMD; Manufacturer 1: Murata; Manufacturer 1 PN: DFE201610P-2R2M=P2; SAP PN: 1100015033; Grade: UNKNOWN; DB Ref: IND-00008; Life Cycle: Released; LRating: 2.2uH; ROHS Comp: YES; Operating Temp: -40℃ to +125℃; SMD/TH: SMD; PB-Free: UNKNOWN
LT1 = IC-00055: IC SWTCH REG O/P ADJ 3A I/P 4.5V-42V SMD 10MSOP; Manufacturer 1: Linear Technology; Manufacturer 1 PN: LT8609AEMSE#WPBF; Manufacturer 2 PN: LT8609AIMSE#PBF; SAP PN: 1100016016; PB-Free: UNKNOWN; Grade: AEC-Q100; DB Ref: IC-00055; Life Cycle: Released; Manufacturer 2: LT; ROHS Comp: YES; Operating Temp: -40°C to +125°C; SMD/TH: SMD; Storage Temp: -65°C to +150°C
Q1 = TRS-00013: MOSFET N-CH 20V 2A SSOT-3; Manufacturer 1: Fairchild; Manufacturer 2 PN: PMV28UNEA; SAP PN: 1100016010; Type: NMOS; SMD/TH: SMD; Grade: UNKNOWN; DB Ref: TRS-00013; Life Cycle: Released; VRating: 20V; Irating: 2A; Manufacturer 1 PN: FDN327N; Manufacturer 2: Nexperia; ROHS Comp: YES; Operating Temp: -55°C to +150°C; Storage Temp: -55°C to +150°C; PB-Free: UNKNOWN
R6 = RES-00030: RES SMD 0E 5% 1/4W 1206; Manufacturer 1: VISHAY; Manufacturer 1 PN: CRCW12060000Z0EA; Manufacturer 2 PN: AA1206JR-070RL; Manufacturer 3 PN: ERJ-8GEY0R00V; SAP PN: 1100013345; Tolerance(%): 5; Grade: UNKNOWN; DB Ref: RES-00030; Life Cycle: Released; Value: 0 R; Manufacturer 2: YAGEO; Manufacturer 3: PANASONIC; ROHS Comp: YES; Operating Temp: -55°C to +155°C; SMD/TH: SMD; PB-Free: UNKNOWN
R7 R9 = RES-00032: RES SMD  47K 1% 1/10W 0603; Manufacturer 1: Yageo; Manufacturer 1 PN: RC0603FR-0747KL; Manufacturer 2 PN: RMCF0603FT47K0; SAP PN: 1100013347; Tolerance(%): 1; Grade: UNKNOWN; DB Ref: RES-00032; Life Cycle: Released; Value: 47K; Manufacturer 2: Stackpole; Manufacturer 3: ROYAL OHM; Manufacturer 3 PN: RMCF0603FT47K0; ROHS Comp: YES; Operating Temp: -55°C to +155°C; SMD/TH: SMD; PB-Free: UNKNOWN
R8 = RES-00036: RES SMD 2.2E 1% 1/4W 1206; Manufacturer 1: Yageo; Manufacturer 1 PN: RC1206FR-072R2L; Manufacturer 2 PN: AC1206FR-072R2L; SAP PN: 1100013352; Tolerance(%): 1; Grade: UNKNOWN; DB Ref: RES-00036; Life Cycle: Released; Value: 2.2E; Manufacturer 2: Yageo; ROHS Comp: YES; Operating Temp: -55°C to +155°C; SMD/TH: SMD; PB-Free: UNKNOWN
R10 R15 = RES-00071: RES SMD DNI 0603; DB Ref: RES-00071; Life Cycle: Preliminary; Value: DNI
R11 = RES-00024: as R2 on sheet Sheet1; DB Ref: RES-00024; Life Cycle: Released; Value: 100K; Manufacturer 2: Stackpole; Manufacturer 3: KOA Speer; ROHS Comp: YES; Operating Temp: -55°C to +155°C; SMD/TH: SMD; PB-Free: UNKNOWN
R12 = RES-00122: RES 18K OHM 1% 1/10W 0603; Manufacturer 1: Panasonic; Manufacturer 1 PN: ERJ-3EKF1802V; Manufacturer 2 PN: CRCW060318K0FKEA; Manufacturer 3 PN: RK73H1JTTD1802F; SAP PN: 1100016014; Tolerance(%): 1; SMD/TH: SMD; Grade: AEC-Q200; PB-Free: UNKNOWN; DB Ref: RES-00122; Life Cycle: Released; Value: 18K; Manufacturer 2: Vishay; Manufacturer 3: KOA Speer; ROHS Comp: YES; Operating Temp: -55°C to +155°C
R13 = RT0603DRE07187KL: RES SMD 187K OHM 0.5% 1/10W 0603; Manufacturer: Yageo; Power (Watts): 0.1W, 1/10W; Temperature Coefficient: ±50ppm/°C; Part Number: RT0603DRE07187KL; Value: 187 kOhms; ComponentLink1Description: Datasheet; ComponentLink1URL: https://www.yageo.com/upload/media/product/productsearch/datasheet/rchip/PYu-RT_1-to-0.01_RoHS_L_11.pdf; ComponentLink2Description: DigiKey Link; ComponentLink2URL: http://digikey.com/product-detail/en/yageo/RT0603DRE07187KL/311-2449-1-ND/6128868; Composition: Thin Film; Device Package: 0603 (1608 Metric); Height - Seated (Max): 0.022" (0.55mm); LastUpdated: 02-09-2020 01:10:14 AM; Lifecycle Status: Active; Minimum Order: 1; Number of Terminations: 2; Operating Temperature: -55°C ~ 155°C; Package / Case: 0603 (1608 Metric); Packaging: TapeAndReel; PartId: 9938; Part Status: Active; Price: 0.01; Resistance: 187 kOhms; Series: RT; Size / Dimension: 0.063" L x 0.031" W (1.60mm x 0.80mm); Supplier 1: DigiKey; Supplier Part Number 1: 311-2449-1-ND; Supplier Device Package: 0603; Tolerance: ±0.5%
R14 = RES-00027: RES SMD 1M 1% 1/10W 0603; Manufacturer 1: Yageo; Manufacturer 1 PN: RC0603FR-071ML; Manufacturer 2 PN: RK73H1JTTDD1004F; Manufacturer 3 PN: ERJ-3EKF1004V; SAP PN: 1100013342; Tolerance(%): 1; Grade: UNKNOWN; DB Ref: RES-00027; Life Cycle: Released; Value: 1M; ROHS Comp: YES; Operating Temp: -55°C to +155°C; SMD/TH: SMD; PB-Free: UNKNOWN; Manufacturer 2: KOA Speer; Manufacturer 3: Panasonic
R16 = RES-00012: as R23 on sheet Sheet4; DB Ref: RES-00012; Life Cycle: Released; Value: 10K; Manufacturer 2: Panasonic; Manufacturer 3: KOA Speer; ROHS Comp: YES; Operating Temp: -55°C to +155°C; SMD/TH: SMD; PB-Free: UNKNOWN
TP1-TP4 = TP-005: TEST_POINT_THROUGH; DB Ref: TP-005; Life Cycle: Approved

## Nets that join several sheets
+5: Sheet1 (R1.2 R2.2 R4.2), Sheet4 (5 pins), Sheet2 (11 pins)
GND: Sheet1 (26 pins), Sheet4 (14 pins), Sheet3 (12 pins), Sheet2 (16 pins)
PVDD: Sheet1 (12 pins), Sheet2 (7 pins)
GVDD: Sheet1 (C7.2 IC1.22), Sheet2 (R8.1)
NetC3_2: Sheet1 (C3.2 IC1.10 R2.1), Sheet4 (J4.7 J4.9)
NetC40_1: Sheet1 (IC1.9), Sheet4 (C40.1 R28.2)
NetC40_2: Sheet1 (IC1.8), Sheet4 (C40.2 R26.2)
NetC44_1: Sheet1 (IC1.16), Sheet4 (C44.1 R32.2)
NetC44_2: Sheet1 (IC1.15), Sheet4 (C44.2 R30.2)
NetIC1_3: Sheet1 (IC1.3), Sheet4 (J4.16)
NetIC1_4: Sheet1 (IC1.4), Sheet4 (J4.18)
NetIC1_11: Sheet1 (IC1.11), Sheet4 (J4.3 J4.5)
NetIC1_17: Sheet1 (IC1.17), Sheet4 (R22.2)
NetJ4_20: Sheet4 (J4.20), Sheet2 (R9.1 R10.1)
OUT1_M: Sheet1 (C2.2 IC1.35), Sheet3 (L3.1)
OUT1_P: Sheet1 (C1.2 IC1.39 IC1.40), Sheet3 (L2.1)
OUT2_M: Sheet1 (C5.1 IC1.27 IC1.28), Sheet3 (L5.1)
OUT2_P: Sheet1 (C4.1 IC1.32), Sheet3 (L4.1)
VDD: Sheet1 (5 pins), Sheet2 (FB1.2 R8.2)